# EAGLE schematic power supply1 (EAGLE 6.5.0)
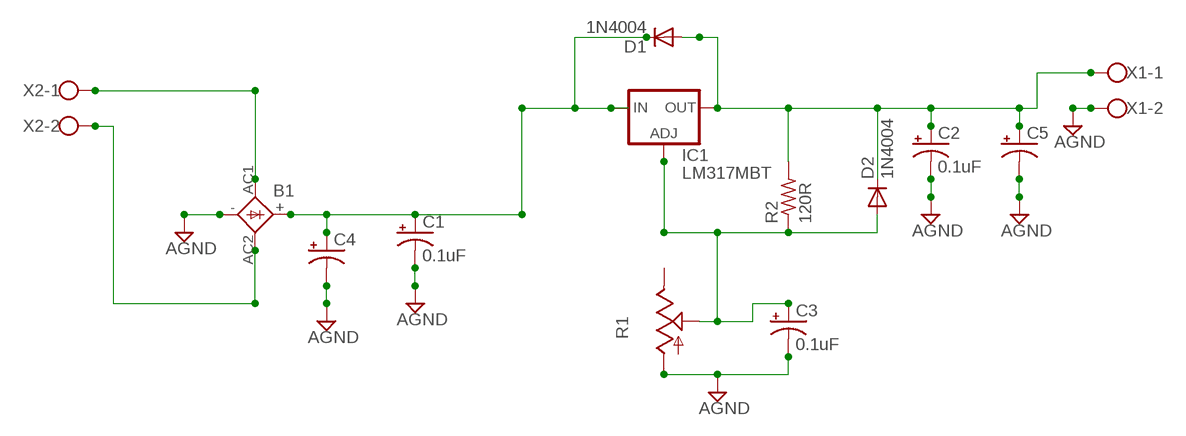
[diagram p0: schematic, sheet 1]

## Parts
B1  GBPC1  [GBPC1]
C1  0.1uF  CPOL-USTAP5-45  [TAP5-45]
C2  0.1uF  CPOL-USTAP5-45  [TAP5-45]
C3  0.1uF  CPOL-USTAP5-45  [TAP5-45]
C4  CPOL-USE7.5-16  [E7,5-16]
C5  CPOL-USE5-8.5  [E5-8,5]
D1  1N4004  [DO41-10]
D2  1N4004  [DO41-10]
IC1  LM317MBT  [TO220L1]
R1  TRIM_US-CA9V  [CA9V]
R2  120R  R-US_0207/10  [0207/10]
X1  W237-102  [W237-102]
X2  W237-102  [W237-102]

## Nets
AGND: B1.- C1.- C2.- C3.- C4.- C5.- R1.A X1.2
N$1: B1.+ C1.+ C4.+ D1.C IC1.3(IN)
N$2: C2.+ C5.+ D1.A D2.C IC1.2(OUT) R2.2 X1.1
N$3: C3.+ D2.A IC1.1(ADJ) R1.S R2.1
N$6: B1.AC1 X2.1
N$7: B1.AC2 X2.2
Unconnected: R1.E

## Library data of the parts
B1 = rectifier:GBPC1: GENERAL INSTRUMENT RECTIFIER
C1-C5 = rcl:CPOL-US: POLARIZED CAPACITOR, American symbol
D1 D2 = diode:1N4004: DIODE general purpose rectifier, 1 A
IC1 = v-reg:LM317?*: 500 mA Adjustable Output Positive Voltage Regulator Source: http://www.onsemi.co.jp .. LM317M-D.PDF
R1 = pot:TRIM_US-: POTENTIOMETER
R2 = rcl:R-US_: RESISTOR, American symbol
X1 X2 = con-wago-500:W237-102: WAGO SCREW CLAMP; MPN: 237-102; OC_FARNELL: unknown; OC_NEWARK: 70K9898